# EAGLE design Base (EAGLE 7.3.0)
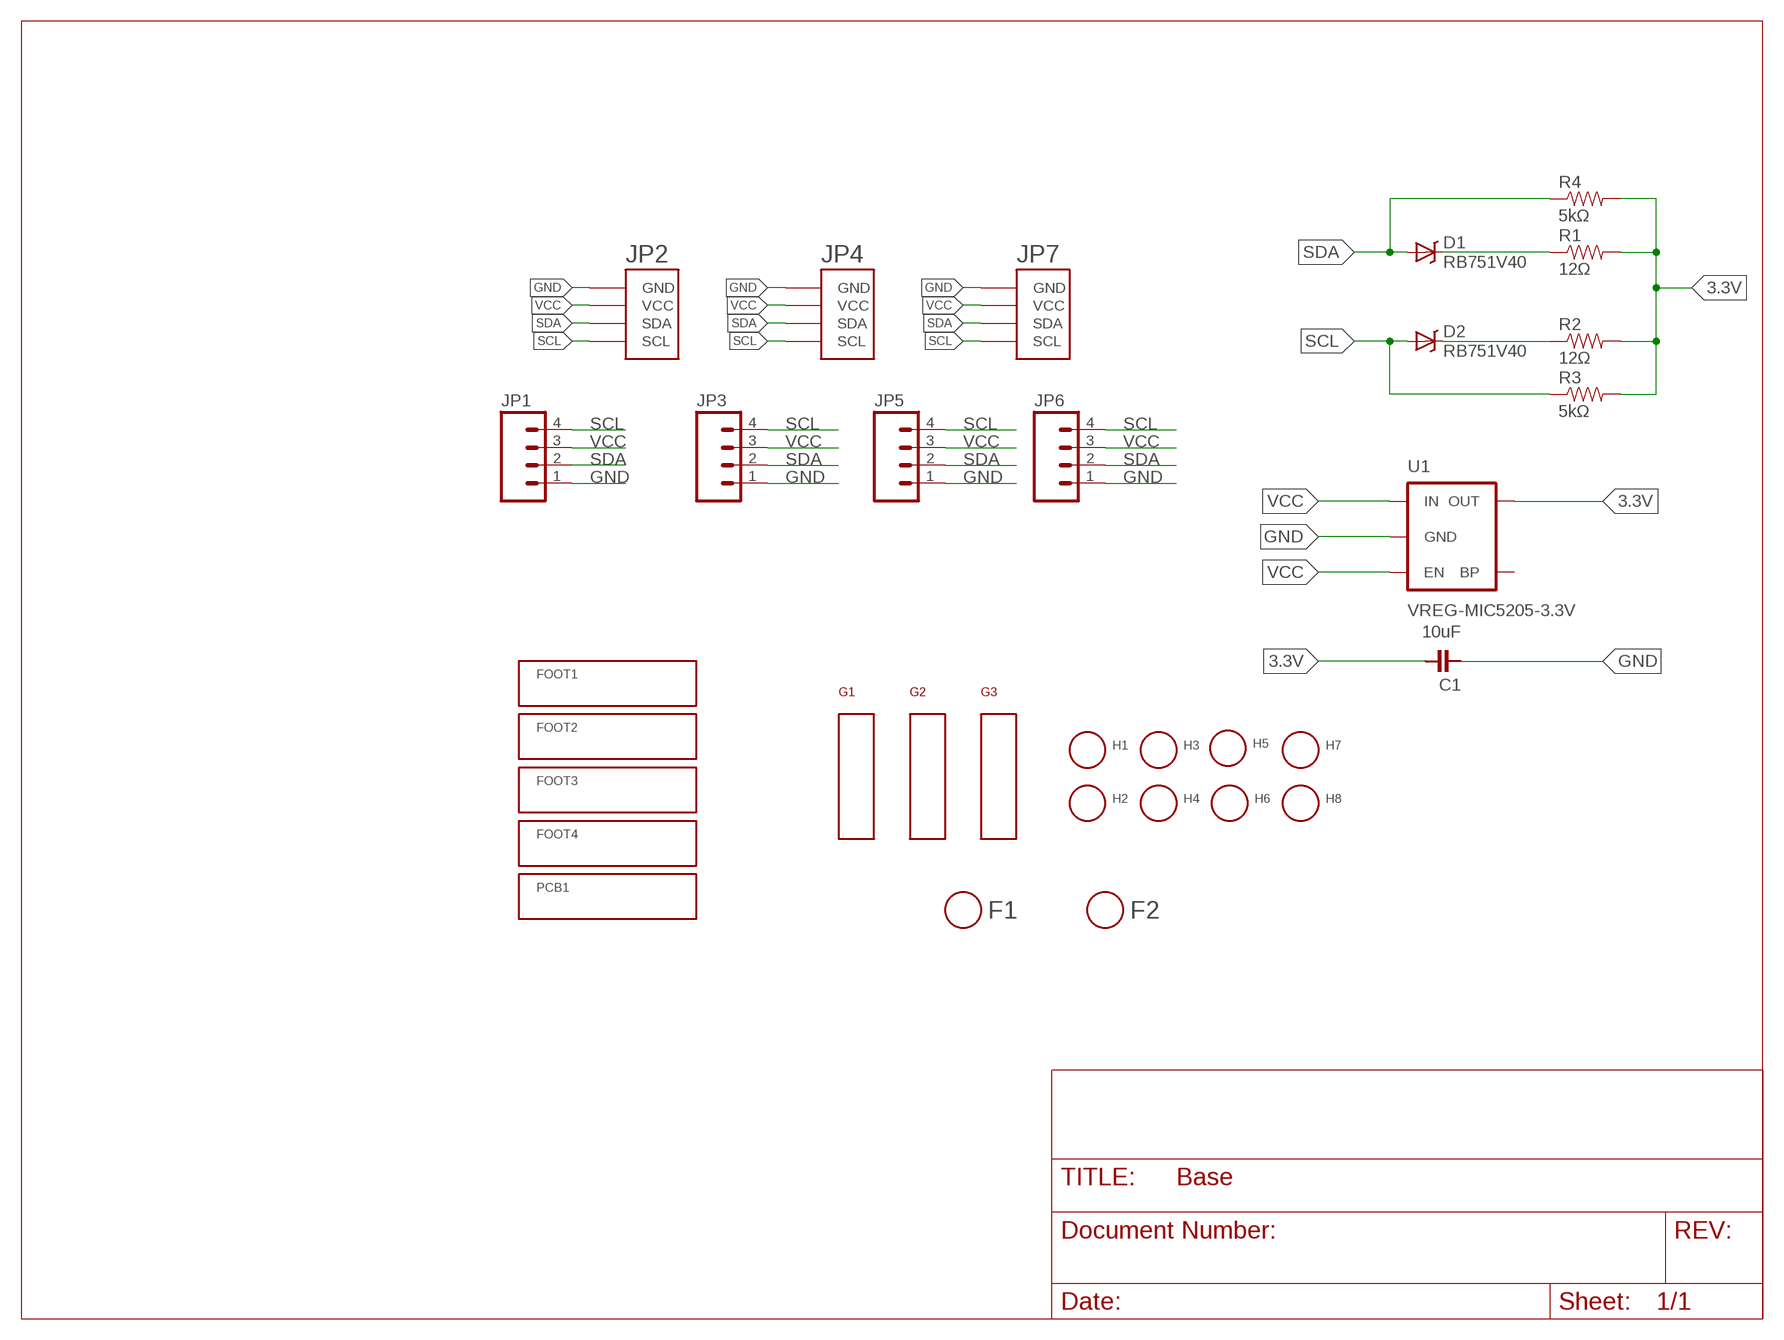
[diagram p0: schematic, sheet 1]
FOOT1 (BOM_ITEM): PARTNUM: SJ61A4
FOOT2 (BOM_ITEM): PARTNUM: SJ61A4
FOOT3 (BOM_ITEM): PARTNUM: SJ61A4
FOOT4 (BOM_ITEM): PARTNUM: SJ61A4
FRAME1 (LETTER_L): BOM: EXCLUDE
PCB1 (BOM_ITEM): DESCRIPTION: PCB; PARTNUM: Base PCB

## Parts
C1  10uF  CAPACITOR-10UF  [0603]
D1  RB751V40  DIODE-SCHOTTKY-BAT60A  [SOD-323]
D2  RB751V40  DIODE-SCHOTTKY-BAT60A  [SOD-323]
F1  FIDUCIAL  [FIDUCIAL_1MM]
F2  FIDUCIAL  [FIDUCIAL_1MM]
G1  CARD-GUIDE  [CARD-GUIDE-2]
G2  CARD-GUIDE  [CARD-GUIDE-2]
G3  CARD-GUIDE  [CARD-GUIDE-2]
H1  HOLE#2  [HOLE-#2]
H2  HOLE#2  [HOLE-#2]
H3  HOLE#2  [HOLE-#2]
H4  HOLE#2  [HOLE-#2]
H5  HOLE#2  [HOLE-#2]
H6  HOLE#2  [HOLE-#2]
H7  HOLE#2  [HOLE-#2]
H8  HOLE#2  [HOLE-#2]
JP1  M04LOCK  [1X04_LOCK]
JP2  HEADER-MODULO  [JST-PA-SIDE-SMD]
JP3  M04LOCK  [1X04_LOCK]
JP4  HEADER-MODULO  [JST-PA-SIDE-SMD]
JP5  M04LOCK  [1X04_LOCK]
JP6  M04LOCK  [1X04_LOCK]
JP7  HEADER-MODULO  [JST-PA-SIDE-SMD]
R1  12Ω  RESISTOR-12Ω  [0603]
R2  12Ω  RESISTOR-12Ω  [0603]
R3  5kΩ  RESISTOR-5KΩ  [0603]
R4  5kΩ  RESISTOR-5KΩ  [0603]
U1  VREG-MIC5205-3.3V  [SOT23-5]

## Nets
3.3V: C1.1 R1.2 R2.2 R3.2 R4.2 U1.5(OUT)
GND: C1.2 JP1.1 JP2.1(GND) JP3.1 JP4.1(GND) JP5.1 JP6.1 JP7.1(GND) U1.2(GND)
N$1: D2.C R2.1
N$3: D1.C R1.1
SCL: D2.A JP1.4 JP2.4(SCL) JP3.4 JP4.4(SCL) JP5.4 JP6.4 JP7.4(SCL) R3.1
SDA: D1.A JP1.2 JP2.3(SDA) JP3.2 JP4.3(SDA) JP5.2 JP6.2 JP7.3(SDA) R4.1
VCC: JP1.3 JP2.2(VCC) JP3.3 JP4.2(VCC) JP5.3 JP6.3 JP7.2(VCC) U1.1(IN) U1.3(EN)
Unconnected: H1.P$1(HOLE) H2.P$1(HOLE) H3.P$1(HOLE) H4.P$1(HOLE) H5.P$1(HOLE) H6.P$1(HOLE) H7.P$1(HOLE) H8.P$1(HOLE) U1.4(BP)

## Library data of the parts
C1 = Modulo:CAPACITOR: Capacitor; PARTNUM: GRM188R61C106MA73D
D1 D2 = Modulo:DIODE-SCHOTTKY; PARTNUM: RB751V40
F1 F2 = Modulo:FIDUCIAL; BOM: EXCLUDE
G1 G3 = Modulo:CARD-GUIDE; PARTNUM: HCG-201-165
G2 = Modulo:CARD-GUIDE; PARTNUM: HCG-202-165
H1 H3 H5 = Modulo:HOLE; NOBOM: 1; PARTNUM: EXCLUDE
H2 H4 H6-H8 = Modulo:HOLE; PARTNUM: EXCLUDE
JP1 JP3 JP5 JP6 = SparkFun-Connectors:M04: Header 4 Standard 4-pin 0.1" header. Use with straight break away headers (SKU : PRT-00116), right angle break away headers (PRT-00553), swiss pins (PRT-00743), machine pins (PRT-00117), and female headers (PRT-00115). Molex polarized connector foot print use with SKU : PRT-08231 with associated crimp pins and housings. 1MM SMD Version SKU: PRT-10208; PARTNUM: M20-9750446
JP2 JP4 JP7 = Modulo:HEADER-MODULO; PARTNUM: 4P-SMD-2.0-90D
R1 R2 = Modulo:RESISTOR: Resistor Basic schematic elements and footprints for 0603, 1206, and PTH resistors.; PARTNUM: ERJ-PA3J120V
R3 R4 = Modulo:RESISTOR: Resistor Basic schematic elements and footprints for 0603, 1206, and PTH resistors.; PARTNUM: ERJ-3EKF5101V
U1 = Modulo:VREG-MIC5205: V_REG MIC5219 Standard 3.3V and 5V 150mA LDO voltage regulator in SOT-23 layout. Micrel part MIC5205. BP (by-pass) pin is used to lower output noise with 470pF cap, may be left open.; PARTNUM: MIC5205-3.3YM5 TR

## Board
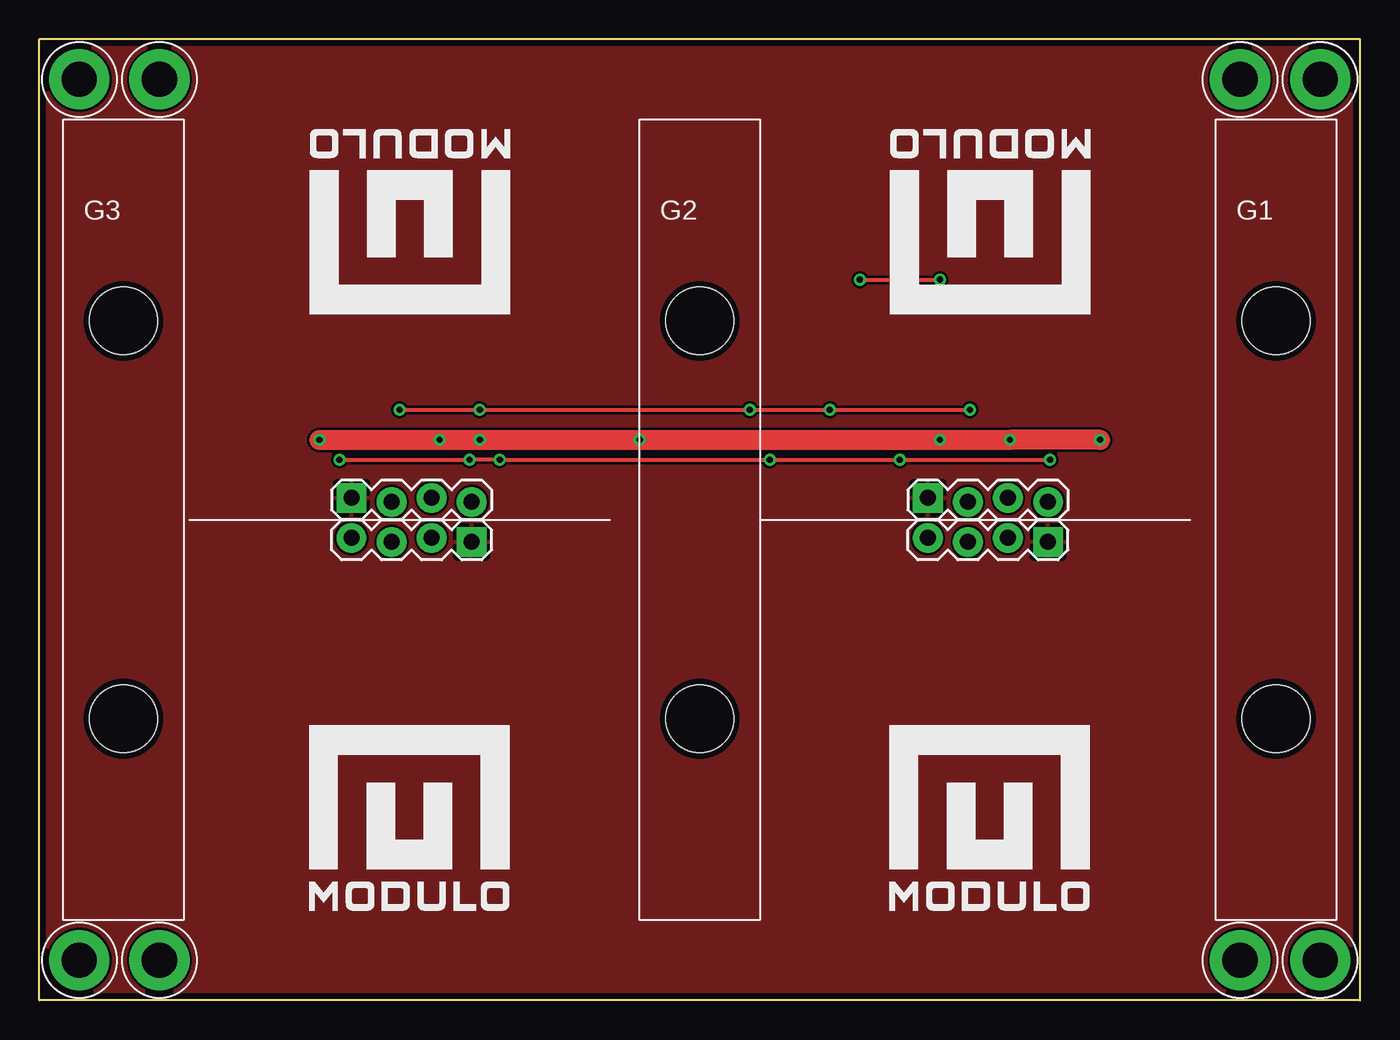
[diagram p1: board, top side]
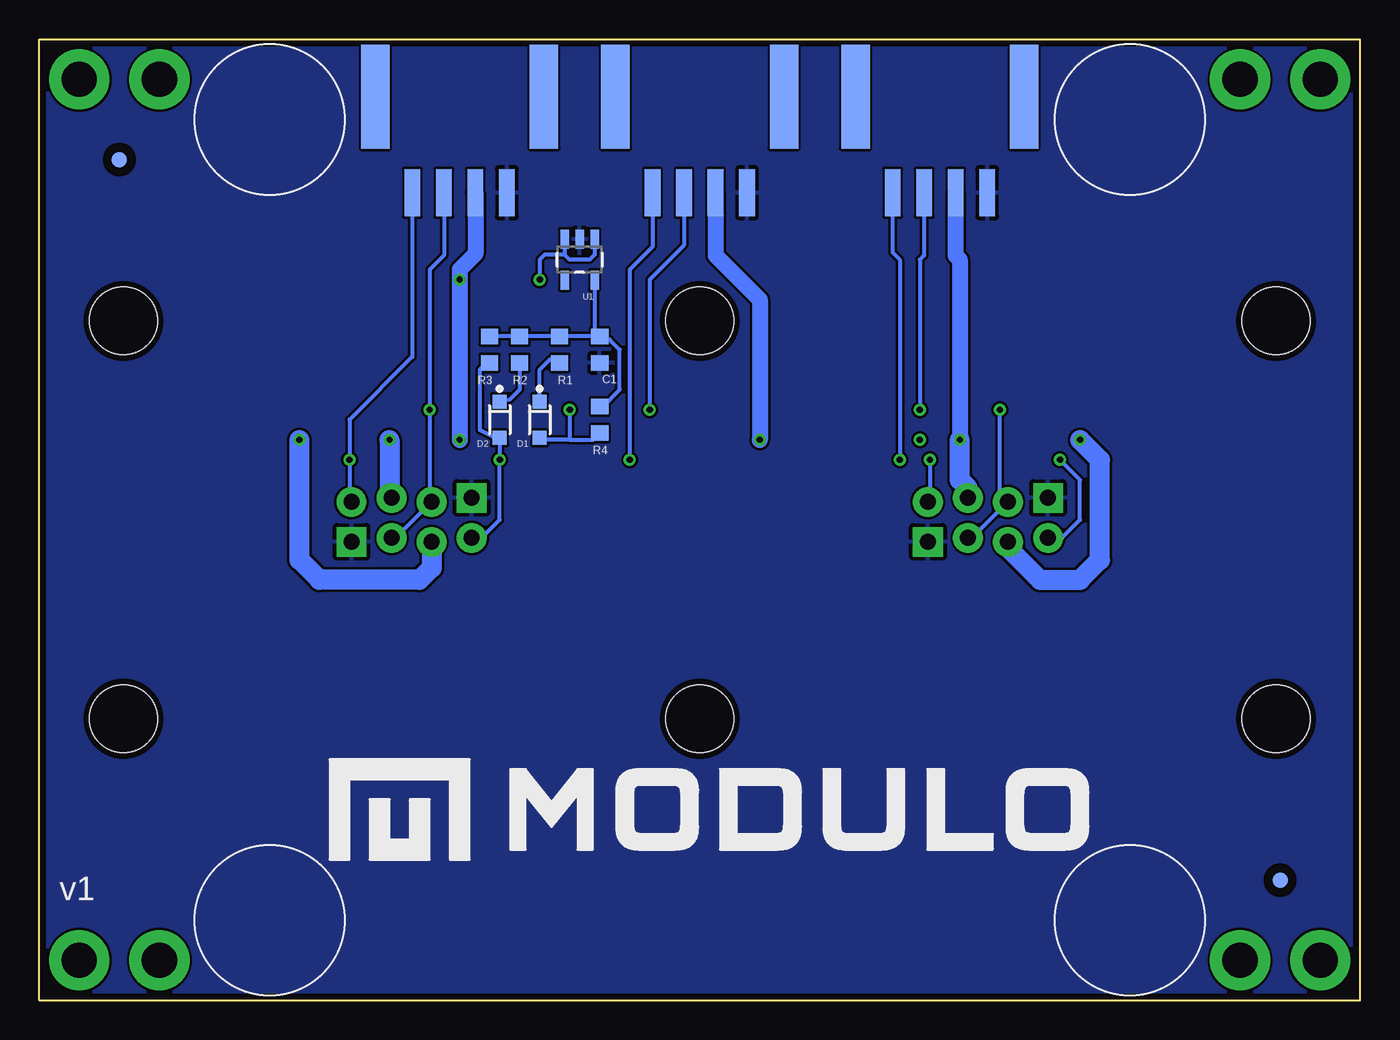
[diagram p2: board, bottom side, seen from below]

Size 83.82 x 60.96 mm. Coordinates in mm from the lower left corner, seen from the top.
Outline: 0,0 0,60.96 83.82,60.96 83.82,0 0,0
Copper layers (1*16): Top 0.0356mm / dielectric 1.5011mm / Bottom 0.0356mm
Design rules "Modulo": minimum track width 6mil, minimum drill 13mil, track to track 6mil, track to pad 6mil, pad to pad 6mil, via to via 6mil, smd to smd 6mil, copper to edge 15mil, drill to drill 6mil, minimum pad ring 7mil, minimum via ring 7mil, stop-mask expansion 3mil, vias tented up to drill 25mil, thermal gap 10mil

### Footprints (pad centres in the part's own frame; a part is rotated, then mirrored left to right if it is on the bottom)
0603 = smd 0.991 x 1.092: 1 -0.838,0; 2 0.838,0
SOD-323 = smd 0.9 x 0.9: A 1.15,0; C -1.15,0
FIDUCIAL_1MM = smd 1 x 1: 1 0,0
CARD-GUIDE-2 = hole 4.293: 0,-12.624; 0,12.624
HOLE-#2 = drill 2.223 pad 3.81: P$1 0,0
1X04_LOCK = drill 1.016 pad 1.88 square: 1 0,0.127 | drill 1.016 pad 1.88: 2 2.54,-0.127; 3 5.08,0.127; 4 7.62,-0.127
JST-PA-SIDE-SMD = smd 1 x 3: 1 -3,9.726; 2 -1,9.726; 3 1,9.726; 4 3,9.726 | smd 1.8 x 6.6: R1 -5.35,3.626; R2 5.35,3.626
SOT23-5 = smd 0.55 x 1.2: 1 -0.95,-1.3; 2 0,-1.3; 3 0.95,-1.3; 4 0.95,1.3; 5 -0.95,1.3

### Placement (x,y rotation side)
C1  48.26,41.27 270 bottom
D1  52.07,36.83 270 bottom
D2  54.61,36.83 270 bottom
F1  5.08,7.62 0 bottom
F2  78.74,53.34 0 bottom
G1  78.49,30.48 0 top
G2  41.91,30.48 0 top
G3  5.33,30.48 0 top
H1  2.54,58.42 0 top
H2  7.62,2.54 0 top
H3  76.2,58.42 0 top
H4  76.2,2.54 0 top
H5  2.54,2.54 0 top
H6  81.28,2.54 0 top
H7  7.62,58.42 0 top
H8  81.28,58.42 0 top
JP1  19.81,31.75 0 top
JP2  26.67,60.96 180 bottom
JP3  27.43,29.21 180 top
JP4  41.91,60.96 180 bottom
JP5  56.39,31.75 0 top
JP6  64.01,29.21 180 top
JP7  57.15,60.96 180 bottom
R1  50.8,41.27 90 bottom
R2  53.34,41.27 90 bottom
R3  55.24,41.27 90 bottom
R4  48.26,36.83 90 bottom
U1  49.53,46.99 180 bottom
U$1  [LOGO-HOR-0.25]  65.41,12.06 0 bottom
U$3  [LOGO-0.5]  23.5,5.71 0 top
U$4  [LOGO-0.5]  60.33,5.71 0 top
U$5  [LOGO-0.5]  60.33,55.24 180 top
U$6  [LOGO-0.5]  23.5,55.24 180 top

### Tracks (layer width: path | path; a pad name or v marks a point on that pad's centre or on a via)
3.3V
  Bottom 0.254: U1.5 48.58,42.43 C1.1 | C1.1 R1.2 R2.2 R3.2 | R4.2 48.06,37.67 46.99,38.73 46.99,41.27 47.62,41.91 48.06,41.91 C1.1
GND
  pour Top: 0,0 0,60.96 83.82,60.96 83.82,0
  pour Bottom: 0,0 0,60.96 83.82,60.96 83.82,0
N$1
  Bottom 0.254: R2.1 53.34,38.73 53.98,38.1 D2.C
N$3
  Bottom 0.254: D1.C 52.07,40.01 51.44,40.64 R1.1
SCL  (via drill 0.41)
  Top 0.254: v19.05,34.29 v27.3,34.29 v29.21,34.29 v46.35,34.29 v54.61,34.29 v64.14,34.29
  Bottom 0.254: JP3.4 18.92,29.34 17.78,30.48 17.78,33.02 v19.05,34.29 | v27.3,34.29 27.3,31.75 JP1.4 | JP6.4 55.75,29.34 54.61,30.48 v54.61,34.29 54.61,35.56 | JP5.4 64.14,31.75 v64.14,34.29 64.14,36.83 60.15,40.81 JP7.4 | v46.35,34.29 46.35,46.35 44.91,47.8 JP4.4 | JP2.4 29.67,47.45 29.21,46.99 v29.21,34.29 | R3.1 55.45,40.44 55.88,40.01 55.88,36.2 54.61,35.56 | D2.A 54.49,35.68 54.61,35.56
SDA  (via drill 0.41)
  Top 0.254: v22.86,37.47 v27.94,37.47 v45.09,37.47 v50.16,37.47 v59.05,37.47
  Bottom 0.254: JP3.2 24.64,29.34 JP1.2 22.73,31.62 22.86,31.75 v22.86,37.47 | JP6.2 61.21,29.34 JP5.2 59.05,31.75 v59.05,37.47 59.05,46.35 58.15,47.26 JP7.3 | JP2.3 27.67,47.26 27.94,46.99 v27.94,37.47 | JP4.3 42.91,47.9 45.09,45.72 v45.09,37.47 | 48.57,35.68 R4.1 48.69,35.56 50.16,35.56 | v50.16,37.47 50.16,35.56 | 50.16,35.56 51.95,35.56 D1.A
VCC  (via drill 0.41)
  Top 0.254: v52.07,45.72 v57.15,45.72
  Top 1.27: v67.31,35.56 v61.59,35.56 v57.15,35.56 v38.1,35.56 v27.94,35.56 v25.4,35.56 v17.78,35.56
  Bottom 0.254: U1.3 50.48,47.31 | U1.1 48.58,47.3 48.9,46.99 50.16,46.99 50.48,47.31 | 50.48,47.31 51.75,47.31 52.07,46.99 v52.07,45.72
  Bottom 1.016: JP2.2 25.67,47.26 25.4,46.99 v25.4,35.56 | JP4.2 40.91,47.26 38.1,44.45 v38.1,35.56 | JP7.2 56.15,47.35 57.15,46.35 v57.15,45.72 v57.15,35.56
  Bottom 1.27: v61.59,35.56 61.59,32 JP5.3 | JP6.3 58.93,27.43 59.69,26.67 66.04,26.67 67.31,27.94 v67.31,35.56 | JP1.3 24.89,32.51 25.4,33.02 v25.4,35.56 | JP3.3 22.35,28.7 20.32,26.67 17.78,26.67 16.51,27.94 16.51,34.29 v17.78,35.56

### Text on the board
bPlace: v1